# EAGLE design scema (EAGLE 6.5.0)
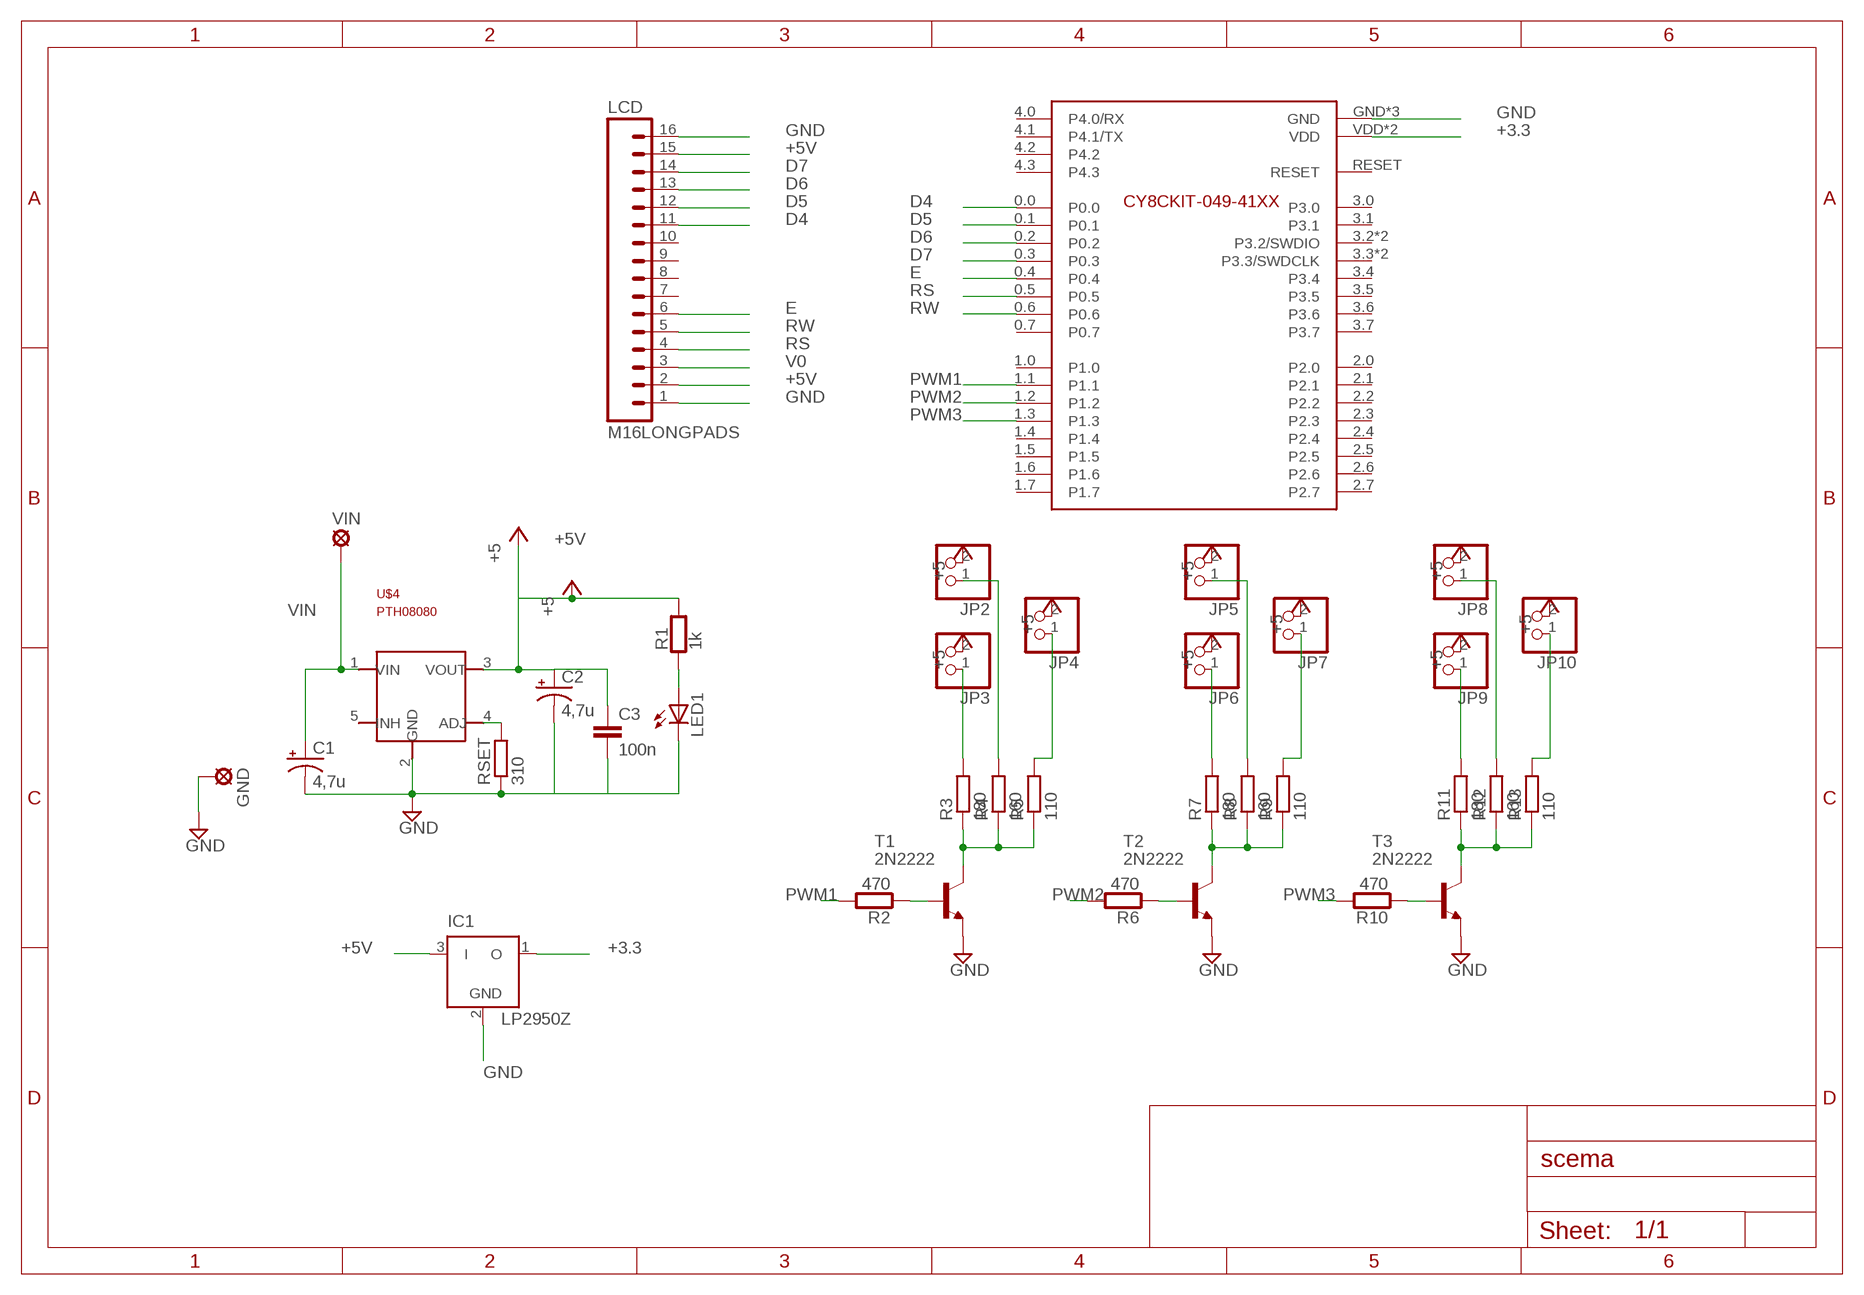
[diagram p0: schematic, sheet 1]

## Parts
C1  4,7u  CAP_POLPTH2  [CPOL-RADIAL-10UF-25V]
C2  4,7u  CAP_POLPTH2  [CPOL-RADIAL-10UF-25V]
C3  100n  CAPPTH2  [CAP-PTH-SMALL2]
GND  SE14  [SE14]
IC1  LP2950Z  [TO92]
JP2  PINHD-1X2  [1X02]
JP3  PINHD-1X2  [1X02]
JP4  PINHD-1X2  [1X02]
JP5  PINHD-1X2  [1X02]
JP6  PINHD-1X2  [1X02]
JP7  PINHD-1X2  [1X02]
JP8  PINHD-1X2  [1X02]
JP9  PINHD-1X2  [1X02]
JP10  PINHD-1X2  [1X02]
LCD  M16LONGPADS  [1X16_LONGPADS]
LED1  LEDSML0805  [SML0805]
R1  1k  R0805  [0805]
R2  470  R0805  [0805]
R3  180  R-EU_0207/12  [0207/12]
R4  160  R-EU_0207/12  [0207/12]
R5  110  R-EU_0207/12  [0207/12]
R6  470  R0805  [0805]
R7  180  R-EU_0207/12  [0207/12]
R8  160  R-EU_0207/12  [0207/12]
R9  110  R-EU_0207/12  [0207/12]
R10  470  R0805  [0805]
R11  180  R-EU_0207/12  [0207/12]
R12  160  R-EU_0207/12  [0207/12]
R13  110  R-EU_0207/12  [0207/12]
RSET  310  R-EU_R0805  [R0805]
T1  2N2222  [TO18]
T2  2N2222  [TO18]
T3  2N2222  [TO18]
U$1  PSOC4DEV  [CY8CKIT-049-41XX]
U$4  PTH08080  [PTH08080EUF]
VIN  SE14  [SE14]

## Nets
+3.3: IC1.1(O) U$1.VDD U$1.VDD2(VDD)
+5V [pow]: C2.1(+) C3.1 IC1.3(I) JP2.2 JP3.2 JP4.2 JP5.2 JP6.2 JP7.2 JP8.2 JP9.2 JP10.2 LCD.2 LCD.15 R1.2 U$4.3(VOUT) ; supply symbol labelled +5
D4: LCD.11 U$1.0.0
D5: LCD.12 U$1.0.1
D6: LCD.13 U$1.0.2
D7: LCD.14 U$1.0.3
E: LCD.6 U$1.0.4
GND [pow]: C1.2(-) C2.2(-) C3.2 GND.MP IC1.2(GND) LCD.1 LCD.16 LED1.C RSET.1 T1.1(E) T2.1(E) T3.1(E) U$1.GND U$1.GND1(GND) U$1.GND2(GND) U$4.2(GND)
N$1: R2.1 T1.2(B)
N$2: R6.1 T2.2(B)
N$5: RSET.2 U$4.4(ADJ)
N$6: JP3.1 R3.2
N$7: R3.1 R4.1 R5.1 T1.3(C)
N$8: JP2.1 R4.2
N$9: JP4.1 R5.2
N$10: JP6.1 R7.2
N$11: R7.1 R8.1 R9.1 T2.3(C)
N$12: LED1.A R1.1
N$13: JP5.1 R8.2
N$14: JP7.1 R9.2
N$15: R10.1 T3.2(B)
N$17: JP9.1 R11.2
N$18: R11.1 R12.1 R13.1 T3.3(C)
N$19: JP8.1 R12.2
N$20: JP10.1 R13.2
PWM1: R2.2 U$1.1.1
PWM2: R6.2 U$1.1.2
PWM3: R10.2 U$1.1.3
RS: LCD.4 U$1.0.5
RW: LCD.5 U$1.0.6
V0: LCD.3
VIN: C1.1(+) U$4.1(VIN) VIN.MP
Unconnected: LCD.7 LCD.8 LCD.9 LCD.10 U$1.0.7 U$1.1.0 U$1.1.4 U$1.1.5 U$1.1.6 U$1.1.7 U$1.2.0 U$1.2.1 U$1.2.2 U$1.2.3 U$1.2.4 U$1.2.5 U$1.2.6 U$1.2.7 U$1.3.0 U$1.3.1 U$1.3.2(P3.2/SWDIO) U$1.3.3(P3.3/SWDCLK) U$1.3.4 U$1.3.5 U$1.3.6 U$1.3.7 U$1.4.0(P4.0/RX) U$1.4.1(P4.1/TX) U$1.4.2 U$1.4.3 U$1.RESET U$1.SWDCLK(P3.3/SWDCLK) U$1.SWDIO(P3.2/SWDIO) U$4.5(INH)

## Library data of the parts
C1 C2 = SparkFun-Passives:CAP_POL: Capacitor Polarized These are standard SMD and PTH capacitors. Normally 10uF, 47uF, and 100uF in electrolytic and tantalum varieties. Always verify the external diameter of the through hole cap, it varies with capacity, voltage, and manufacturer. The EIA devices should be standard.
C3 = SparkFun-Passives:CAP: Capacitor Standard 0603 ceramic capacitor, and 0.1" leaded capacitor.
GND VIN = solpad:SE14: SOLDER PAD E1553, drill 1,4mm, distributor Buerklin, 07F820
IC1 = linear:LP2950: 100 mA, Low Power Low Dropout Voltage Regulator Source: http://www.onsemi.com/pub/Collateral/LP2950-D.PDF
JP2-JP10 = pinhead:PINHD-1X2: PIN HEADER
LCD = SparkFun-Connectors:M16: 1x16 .1" header
LED1 = led:LED: LED OSRAM: - CHIPLED LG R971, LG N971, LY N971, LG Q971, LY Q971, LO R971, LY R971 LH N974, LH R974 LS Q976, LO Q976, LY Q976 LO Q996 - Hyper CHIPLED LW Q18S LB Q993, LB Q99A, LB R99A - SideLED LS A670, LO A670, LY A670, LG A670, LP A670 LB A673, LV A673, LT A673, LW A673 LH A674 LY A675 LS A676, LA A676, LO A676, LY A676, LW A676 LS A679, LY A679, LG A679 - Hyper Micro SIDELED® LS Y876, LA Y876, LO Y876, LY Y876 LT Y87S - SmartLED LW L88C, LW L88S LB L89C, LB L89S, LG L890 LS L89K, LO L89K, LY L89K LS L896, LA L896, LO L896, LY L896 - TOPLED LS T670, LO T670, LY T670, LG T670, LP T670 LSG T670, LSP T670, LSY T670, LOP T670, LYG T670 LG T671, LOG T671, LSG T671 LB T673, LV T673, LT T673, LW T673 LH T674 LS T676, LA T676, LO T676, LY T676, LB T676, LH T676, LSB T676, LW T676 LB T67C, LV T67C, LT T67C, LS T67K, LO T67K, LY T67K, LW E67C LS E67B, LA E67B, LO E67B, LY E67B, LB E67C, LV E67C, LT E67C LW T67C LS T679, LY T679, LG T679 LS T770, LO T770, LY T770, LG T770, LP T770 LB T773, LV T773, LT T773, LW T773 LH T774 LS E675, LA E675, LY E675, LS T675 LS T776, LA T776, LO T776, LY T776, LB T776 LHGB T686 LT T68C, LB T68C - Hyper Mini TOPLED® LB M676 - Mini TOPLED Santana® LG M470 LS M47K, LO M47K, LY M47K Source: http://www.osram.convergy.de LUXEON: - LUMILED® LXK2-PW12-R00, LXK2-PW12-S00, LXK2-PW14-U00, LXK2-PW14-V00 LXK2-PM12-R00, LXK2-PM12-S00, LXK2-PM14-U00 LXK2-PE12-Q00, LXK2-PE12-R00, LXK2-PE12-S00, LXK2-PE14-T00, LXK2-PE14-U00 LXK2-PB12-K00, LXK2-PB12-L00, LXK2-PB12-M00, LXK2-PB14-N00, LXK2-PB14-P00, LXK2-PB14-Q00 LXK2-PR12-L00, LXK2-PR12-M00, LXK2-PR14-Q00, LXK2-PR14-R00 LXK2-PD12-Q00, LXK2-PD12-R00, LXK2-PD12-S00 LXK2-PH12-R00, LXK2-PH12-S00 LXK2-PL12-P00, LXK2-PL12-Q00, LXK2-PL12-R00 Source: www.luxeon.com KINGBRIGHT: KA-3528ASYC Source: www.kingbright.com
R1 R2 R6 R10 = mbed-rlcq:R
R3-R5 R7-R9 R11-R13 RSET = rcl:R-EU_: RESISTOR, European symbol
T1-T3 = transistor:2N2222: NPN TRANSISTOR
U$1 = PSoC4-devkit:PSOC4DEV
U$4 = PTH08080:PTH08080: DC-DC, Vin 5..18V, Vout 2..6V, 2A www.ti.com

## Net classes
0 VIN: width 0.6 mm
1 pow: width 0.508 mm

## Board
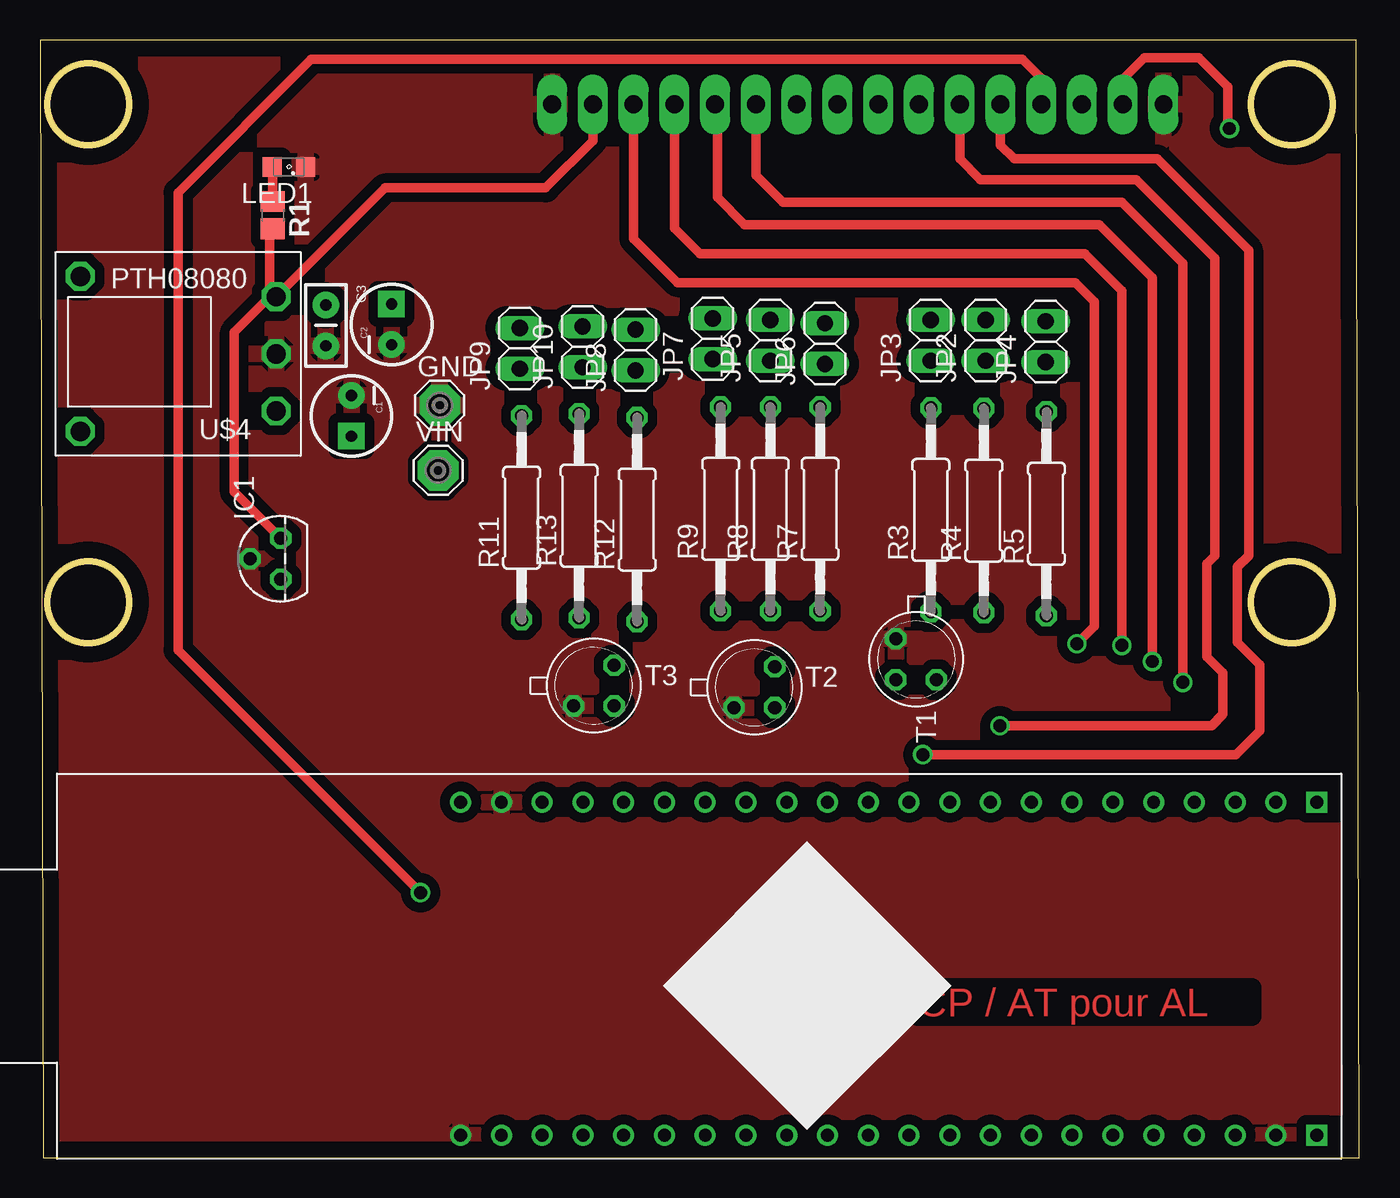
[diagram p1: board, top side]
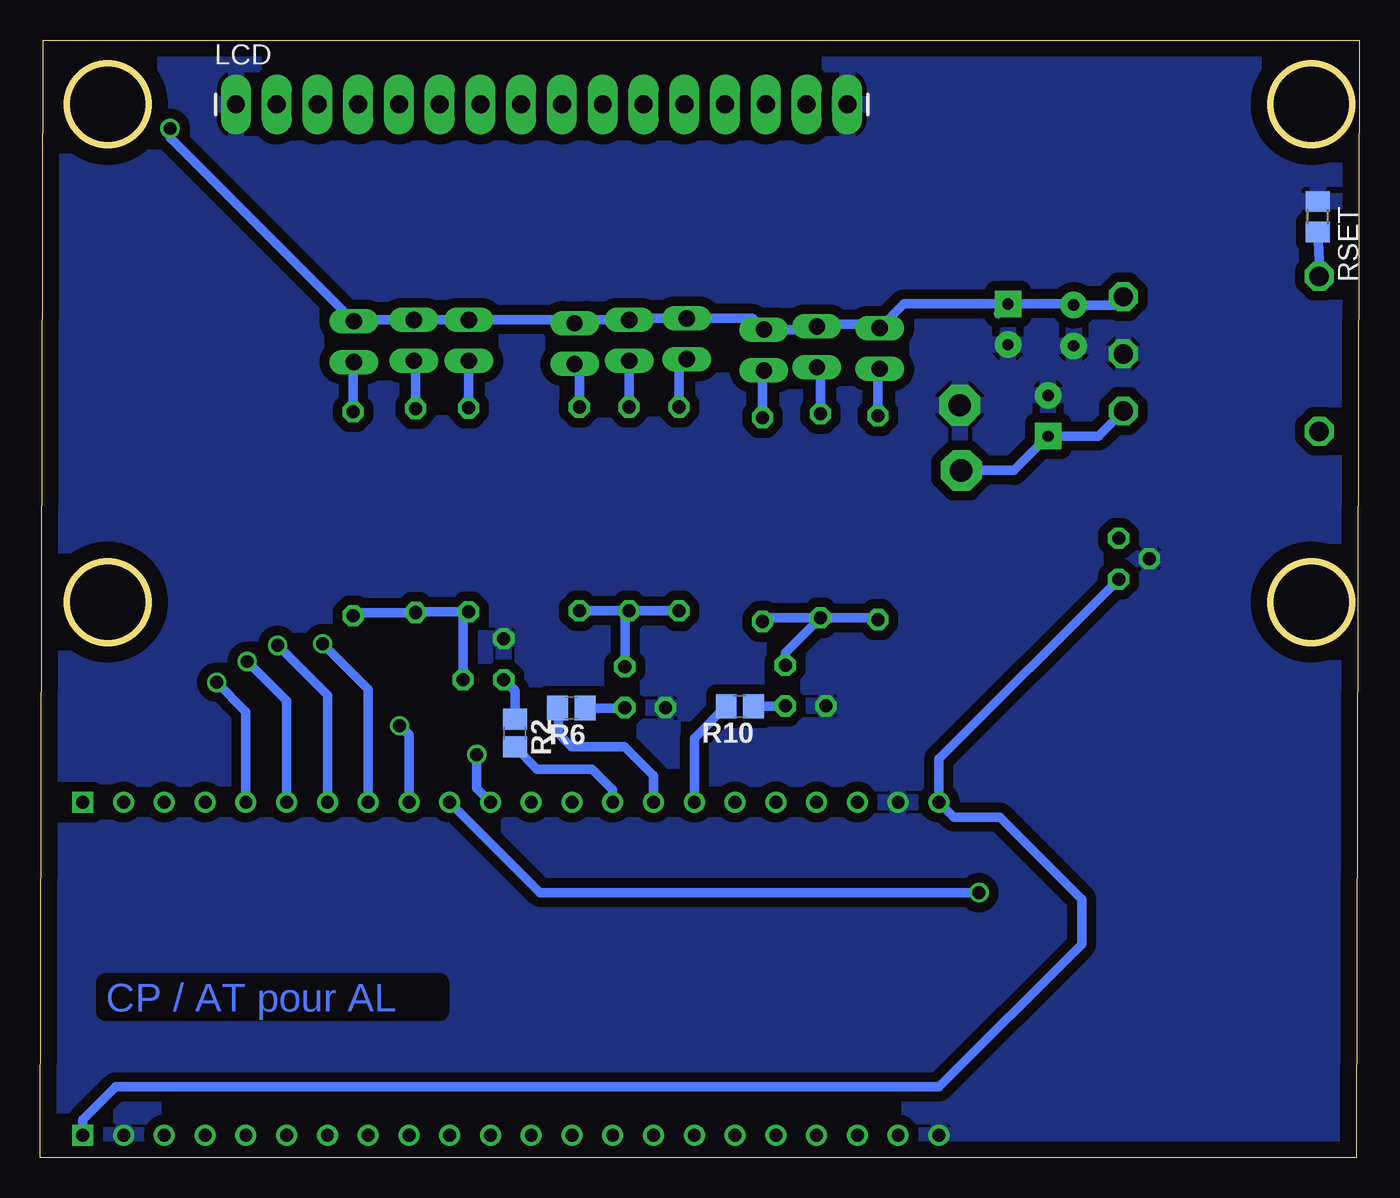
[diagram p2: board, bottom side, seen from below]

Size 82.2 x 69.6 mm. Coordinates in mm from the lower left corner, seen from the top.
Outline: 0.2,0 82.2,0 82,69.6 0,69.6 0.2,0
Outline: circle at 3,65.6 radius 2.54
Outline: circle at 78,65.6 radius 2.54
Outline: circle at 3,34.6 radius 2.54
Outline: circle at 78,34.6 radius 2.54
Copper layers (1*16): Top 0.1mm / dielectric 1.5mm / Bottom 0.1mm
Design rules "ensea": minimum track width 0.5mm, minimum drill 0.5mm, track to track 0.5mm, track to pad 0.5mm, pad to pad 0.5mm, via to via 0.5mm, smd to smd 8mil, copper to edge 40mil, drill to drill 8mil, minimum pad ring 10mil, minimum via ring 8mil, stop-mask expansion 4mil, vias tented up to drill 0mil, thermal gap 10mil

### Footprints (pad centres in the part's own frame; a part is rotated, then mirrored left to right if it is on the bottom)
CPOL-RADIAL-10UF-25V = drill 0.7 pad 1.651 square: 1 1.27,0 | drill 0.7 pad 1.651: 2 -1.27,0
CAP-PTH-SMALL2 = drill 0.7 pad 1.651: 1 0,0; 2 2.54,0
SE14 = drill 1.397 pad 2.54 octagon: MP 0,0
TO92 = drill 0.813 octagon: 1 -1.27,0; 2 0,1.905; 3 1.27,0
1X02 = drill 1.016 long: 1 -1.27,0; 2 1.27,0
1X16_LONGPADS = drill 1.118 pad 1.88 long: 1 0,0; 2 2.54,0; 3 5.08,0; 4 7.62,0; 5 10.16,0; 6 12.7,0; 7 15.24,0; 8 17.78,0; 9 20.32,0; 10 22.86,0; 11 25.4,0; 12 27.94,0; 13 30.48,0; 14 33.02,0; 15 35.56,0; 16 38.1,0
SML0805 = smd 1.2 x 1.2: A 1.05,0; C -1.05,0
0805 = smd 1.3 x 1.5: 1 -0.85,0; 2 0.85,0
0207/12 = drill 0.813 octagon: 1 -6.35,0; 2 6.35,0
R0805 = smd 1.3 x 1.5: 1 -0.95,0; 2 0.95,0
TO18 = drill 0.813 octagon: 1 -1.27,-1.27; 2 1.27,-1.27; 3 1.27,1.27
CY8CKIT-049-41XX = drill 0.8: 0.0 -10.16,22.86; 0.1 -10.16,20.32; 0.2 -10.16,17.78; 0.3 -10.16,15.24; 0.4 -10.16,12.7; 0.5 -10.16,10.16; 0.6 -10.16,7.62; 0.7 -10.16,5.08; 1.0 -10.16,2.54; 1.1 -10.16,0; 1.2 -10.16,-2.54; 1.3 -10.16,-5.08; 1.4 -10.16,-7.62; 1.5 -10.16,-10.16; 1.6 -10.16,-12.7; 1.7 -10.16,-15.24; 2.0 10.59,-17.78; 2.1 10.59,-15.24; 2.2 10.59,-12.7; 2.3 10.59,-10.16; 2.4 10.59,-7.62; 2.5 10.59,-5.08; 2.6 10.59,-2.54; 2.7 10.59,0; 3.0 10.59,2.54; 3.1 10.59,5.08; 3.2 10.59,7.62; 3.3 10.59,10.16; 3.4 10.59,12.7; 3.5 10.59,15.24; 3.6 10.59,17.78; 3.7 10.59,20.32; 4.1 -10.16,30.48; 4.2 -10.16,27.94; 4.3 -10.16,25.4; GND -10.16,-17.78; GND1 10.59,-20.32; GND2 10.59,30.48; RESET 10.59,27.94; SWDCLK 10.59,25.4; SWDIO 10.59,22.86; VDD -10.16,-20.32 | drill 0.8 square: 4.0 -10.16,33.02; VDD2 10.59,33.02
PTH08080EUF = drill 1.2 octagon: 1 0,0; 2 0,-3.556; 3 0,-7.112; 4 12.192,-8.382; 5 12.192,1.27

### Placement (x,y rotation side)
C1  19.4,46.2 270 top
C2  21.9,51.9 90 top
C3  17.8,53.1 270 top
GND  24.9,46.86 0 top
IC1  15,37.3 90 top
JP2  58.92,50.9 90 top
JP3  55.48,50.9 90 top
JP4  62.66,50.82 90 top
JP5  45.5,50.9 90 top
JP6  48.9,50.7 90 top
JP7  41.9,51 90 top
JP8  37.1,50.3 90 top
JP9  29.88,50.4 90 top
JP10  33.8,50.5 90 top
LCD  70,65.6 0 bottom
LED1  15.5,61.7 180 top
R1  14.5,58.7 270 top
R2  52.62,26.44 270 bottom
R3  55.5,40.34 90 top
R4  58.8,40.3 90 top
R5  62.7,40.1 90 top
R6  49.1,28 180 bottom
R7  48.6,40.4 90 top
R8  45.5,40.4 90 top
R9  42.4,40.4 90 top
R10  38.6,28.1 180 bottom
R11  30,39.86 90 top
R12  37.2,39.74 90 top
R13  33.58,39.98 90 top
RSET  2.6,58.6 270 bottom
T1  54.58,31.04 270 top
T2  44.5,29.3 0 top
T3  34.5,29.4 0 top
U$1  46.52,11.98 270 top
U$4  14.7,46.5 180 top
VIN  24.8,42.8 0 top

### Tracks (layer width: path | path; a pad name or v marks a point on that pad's centre or on a via)
+3.3
  Bottom 0.6: IC1.1 26.2,24.83 U$1.VDD 25.26,21.2 22.4,21.2 17.3,16.1 17.3,13.3 26.2,4.4 77.5,4.4 79.54,2.36 U$1.VDD2
+5V  (via drill 0.8)
  Top 0.6: IC1.3 12.1,41.47 12.1,51.4 14.31,53.61 | 14.31,53.61 U$4.3 21.49,60.4 31.5,60.4 34.44,63.34 LCD.15 | LCD.2 67.46,67.16 68.8,68.5 72.2,68.5 74,66.7 74,64.2 v74.1,64.1 | 14.31,53.61 14.31,57.66 R1.2
  Bottom 0.6: U$4.3 15.21,53.1 C3.1 17.87,53.17 C2.1 | C2.1 22.5,52.57 | JP3.2 JP2.2 62.58,52.17 JP4.2 74.1,63.53 v74.1,64.1 | JP3.2 55.28,51.97 | C2.1 28.38,53.17 JP9.2 30.11,51.9 34.3,51.9 34.17,51.77 JP10.2 34,51.57 JP8.2 37.8,52.27 JP7.2 45.4,52.27 JP5.2 48.7,52.17 JP6.2 49.1,52.17 JP3.2
D4  (via drill 0.8)
  Top 0.6: LCD.11 44.6,61.2 46.3,59.5 67.4,59.5 71.2,55.7 v71.2,29.6
  Bottom 0.6: v71.2,29.6 69.38,27.78 U$1.0.0
D5  (via drill 0.8)
  Top 0.6: v69.3,30.9 69.3,54.8 66,58.1 43.9,58.1 42.2,59.8 42.2,65.46 LCD.12
  Bottom 0.6: v69.3,30.9 66.84,28.44 U$1.0.1
D6  (via drill 0.8)
  Top 0.6: LCD.13 39.52,57.88 41.1,56.3 65.1,56.3 67.4,54 v67.4,31.9
  Bottom 0.6: v67.4,31.9 64.3,28.8 U$1.0.2
D7  (via drill 0.8)
  Top 0.6: LCD.14 36.98,57.22 39.7,54.5 64.5,54.5 65.7,53.3 65.7,33.1 v64.6,32
  Bottom 0.6: v64.6,32 61.76,29.16 U$1.0.3
E  (via drill 0.8)
  Top 0.6: LCD.6 57.3,62.2 58.6,60.9 68.3,60.9 73.2,56 73.2,37.5 72.7,37 72.7,31.2 73.7,30.2 73.7,27.6 73,26.9 v59.8,26.9
  Bottom 0.6: v59.8,26.9 59.22,26.32 U$1.0.4
GND
  pour Top (isolate 0.61): -1.8,71.2 85.2,70.7 85.5,-2.8 -1.5,-3.8 -0.8,52.2
  pour Bottom (isolate 0.61): -3.3,71.2 85.7,71.2 86.5,-2 -2.5,-2
N$1
  Bottom 0.6: R2.1 52.62,29.08 T1.2
N$2
  Bottom 0.6: R6.1 45.8,28 T2.2
N$5
  Bottom 0.6: RSET.2 2.47,55.28 U$4.4
N$6
  Bottom 0.6: JP3.1 55.5,49.61 R3.2
N$7
  Bottom 0.6: R5.1 62.5,33.95 R4.1 58.76,33.99 R3.1 55.85,33.64 T1.3
N$8
  Bottom 0.6: JP2.1 58.8,49.51 R4.2
N$9
  Bottom 0.6: JP4.1 62.7,49.51 R5.2
N$10
  Bottom 0.6: JP6.1 48.6,49.13 R7.2
N$11
  Bottom 0.6: R8.1 R9.1 | R8.1 R7.1 | R8.1 45.77,33.78 T2.3
N$12
  Top 0.6: R1.1 14.5,61.65 LED1.A
N$13
  Bottom 0.6: JP5.1 R8.2
N$14
  Bottom 0.6: JP7.1 42.4,49.23 R9.2
N$15
  Bottom 0.6: R10.1 35.8,28.1 T3.2
N$17
  Bottom 0.6: JP9.1 30,49.01 R11.2
N$18
  Bottom 0.6: R13.1 30.12,33.63 R11.1 | R13.1 36.96,33.63 R12.1 | R13.1 35.77,31.44 T3.3
N$19
  Bottom 0.6: JP8.1 37.2,48.93 R12.2
N$20
  Bottom 0.6: JP10.1 33.58,49.01 R13.2
PWM1
  Bottom 0.6: U$1.1.1 46.52,22.92 47.8,24.2 51.23,24.2 R2.2
PWM2
  Bottom 0.6: U$1.1.2 43.98,23.78 45.8,25.6 49.1,25.6 49.9,26.4 49.9,27.95 R6.2
PWM3
  Bottom 0.6: U$1.1.3 41.44,26.11 R10.2
RS  (via drill 0.8)
  Top 0.6: LCD.4 62.38,67.22 61.2,68.4 16.9,68.4 8.6,60.1 8.6,31.6 v23.7,16.5
  Bottom 0.6: v23.7,16.5 51.04,16.5 U$1.0.5
RW  (via drill 0.8)
  Top 0.6: LCD.5 59.84,63.06 60.7,62.2 69.6,62.2 75.3,56.5 75.3,37.5 74.6,36.8 74.6,32.1 76,30.7 76,26.6 74.5,25.1 v55,25.1
  Bottom 0.6: v55,25.1 55,23 U$1.0.6
VIN
  Bottom 0.6: U$4.1 16.27,44.93 C1.1 21.53,42.8 VIN.MP

### Text on the board
Top: CP / AT pour AL
Bottom: CP / AT pour AL